# Altium schematic sheet TI_ADC_VOLTAGE.SchDoc
size 500 x 500 mm
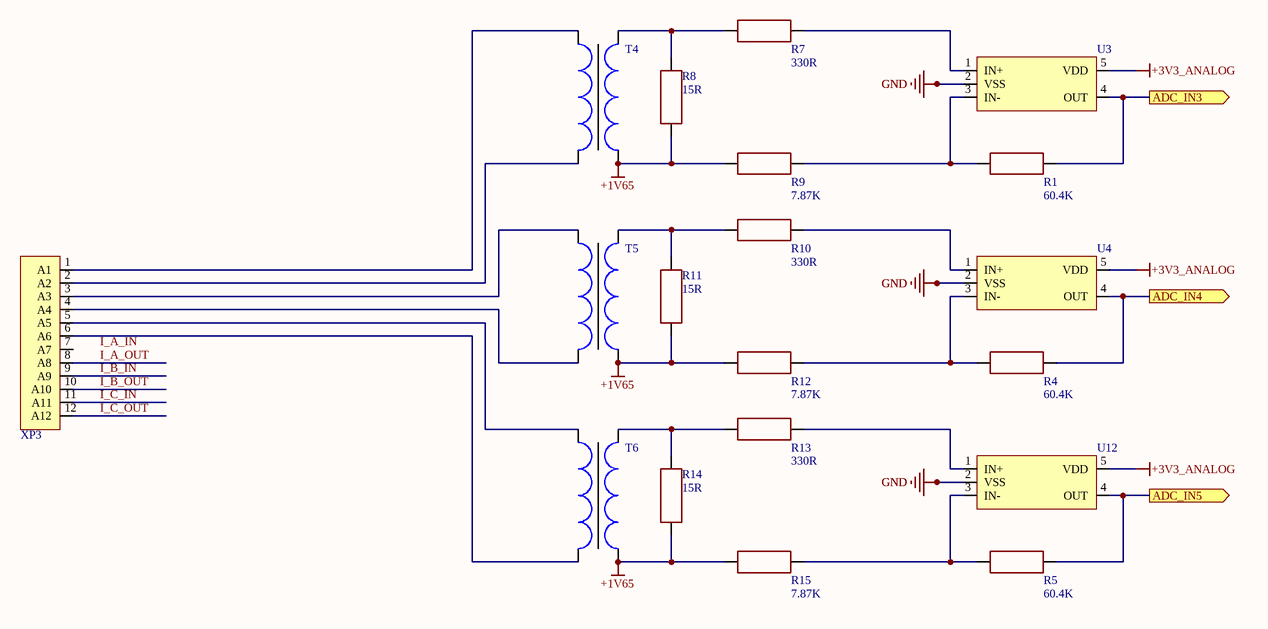
[diagram p0: TI_ADC_VOLTAGE.SchDoc]

## Parts
R1  value 60.4K  [RES: 0603]  (hidden comment: Resistor_0603)
R4  value 60.4K  [RES: 0603]  (hidden comment: Resistor_0603)
R5  value 60.4K  [RES: 0603]  (hidden comment: Resistor_0603)
R7  value 330R  [RES: 0603]  (hidden comment: Resistor_0603)
R8  value 15R  [RES: 0603]  (hidden comment: Resistor_0603)
R9  value 7.87K  [RES: 0603]  (hidden comment: Resistor_0603)
R10  value 330R  [RES: 0603]  (hidden comment: Resistor_0603)
R11  value 15R  [RES: 0603]  (hidden comment: Resistor_0603)
R12  value 7.87K  [RES: 0603]  (hidden comment: Resistor_0603)
R13  value 330R  [RES: 0603]  (hidden comment: Resistor_0603)
R14  value 15R  [RES: 0603]  (hidden comment: Resistor_0603)
R15  value 7.87K  [RES: 0603]  (hidden comment: Resistor_0603)
T4  TV31B02  [TV31B02]  (value not drawn)
T5  TV31B02  [TV31B02]  (value not drawn)
T6  TV31B02  [TV31B02]  (value not drawn)
U3  MCP6001U  [SOT-23-5]  (value not drawn)
U4  MCP6001U  [SOT-23-5]  (value not drawn)
U12  MCP6001U  [SOT-23-5]  (value not drawn)
XP3  PLS-6 (DS1MSTB 2,5/12-GF-5,08021-1x6)  [MSTB 2,5/12-GF-5,08]  (value not drawn)

## Ports
ADC_IN3 (out), ADC_IN4 (out), ADC_IN5 (out)

## Nets
+1V65: R8.2 R9.1 R11.2 R12.1 R14.2 R15.1 T4.2 T5.2 T6.2
+3V3_ANALOG: U3.5(VDD) U4.5(VDD) U12.5(VDD)
GND: U3.2(VSS) U4.2(VSS) U12.2(VSS)
ADC_IN3: R1.1 U3.4(OUT) ; port ADC_IN3
ADC_IN4: R4.1 U4.4(OUT) ; port ADC_IN4
ADC_IN5: R5.1 U12.4(OUT) ; port ADC_IN5
I_A_OUT: XP3.8(A8)
I_B_IN: XP3.9(A9)
I_B_OUT: XP3.10(A10)
I_C_IN: XP3.11(A11)
I_C_OUT: XP3.12(A12)
NetR1_2: R1.2 R9.2 U3.3(IN-)
NetR4_2: R4.2 R12.2 U4.3(IN-)
NetR5_2: R5.2 R15.2 U12.3(IN-)
NetR7_1: R7.1 R8.1 T4.1
NetR7_2: R7.2 U3.1(IN+)
NetR10_1: R10.1 R11.1 T5.1
NetR10_2: R10.2 U4.1(IN+)
NetR13_1: R13.1 R14.1 T6.1
NetR13_2: R13.2 U12.1(IN+)
NetT4_3: T4.3 XP3.2(A2)
NetT4_4: T4.4 XP3.1(A1)
NetT5_3: T5.3 XP3.4(A4)
NetT5_4: T5.4 XP3.3(A3)
NetT6_3: T6.3 XP3.6(A6)
NetT6_4: T6.4 XP3.5(A5)

Not connected (* = marked no-connect by the designer): XP3 7(A7)

## Notes on the sheet
- Labels drawn without touching a wire or pin: I_A_IN

## Library data of the parts
R1 R4 R5 R7-R15 = Resistor_0603: Power: 0.1W; Tolerance: ±5%; Package/Case: 0603; Temperature: -55...+125°C; Product Category: Resistors
T4-T6 = TV31B02: Current-type Voltage Transformer; Manufacturer: YUANXING; Analogue: ZMPT101B(https://5nrorwxhmqqijik.leadongcdn.com/ZMPT101B+specification-aidijBqoKomRilSqqokpjkp.pdf); Datasheet: https://www.yuanxing.net/pdf/current%20type%20voltage%20transformers.pdf; Product Category: Current-type Voltage Transformer
U3 U4 U12 = MCP6001U: 1 MHz, Low-Power Op Amp; Manufacturer: Microchip; Datasheet: https://eu.mouser.com/ProductDetail/Microchip-Technology-Atmel/MCP6004-I-SL?qs=n%2FfJlMG9rCZ2%2F%2FCryvZ52w%3D%3D; HelpURL: https://eu.mouser.com/ProductDetail/Microchip-Technology-Atmel/MCP6001UT-I-OT?qs=Sez7gRs8XSU2iw24kVuIOw%3D%3D; Package/Case: SOT-23-5; Product Category: Operational Amplifiers
XP3 = MSTB 2,5/12-GF-5,08: Surface Mount, Single row, 12 Positions, 5.08mm; Manufacturer: Phoenix contact; Datasheet: https://www.phoenixcontact.com/ru-pc/produkty/korpusnaa-cast-dla-pecatnyh-plat-mstb-25-12-gf-508-1776605; HelpURL: https://www.phoenixcontact.com/ru-pc/produkty/korpusnaa-cast-dla-pecatnyh-plat-mstb-25-12-gf-508-1776605; Product Category: Connectors